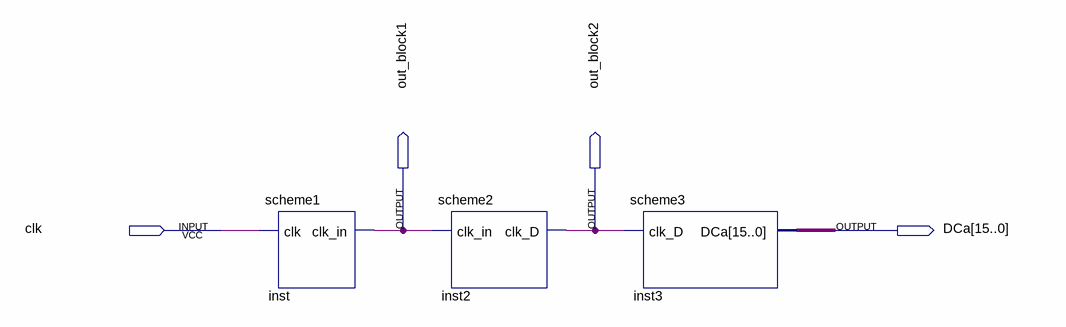
[diagram p0: schematic sheet]
// Quartus schematic result.bdf as structural Verilog: 3 symbols, 4 pins
module result (
  input  clk,
  output out_block1,
  output out_block2,
  output [15:0] DCa
);

  scheme1 inst (.clk(clk), .clk_in(out_block1));
  scheme2 inst2 (.clk_in(out_block1), .clk_D(out_block2));
  scheme3 inst3 (.clk_D(out_block2), .DCa(DCa));
endmodule
